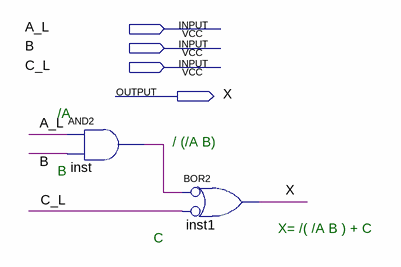
[diagram p0: schematic sheet]
// Quartus schematic first.bdf as structural Verilog: 2 symbols, 4 pins
module first (
  input  A_L,
  input  B,
  input  C_L,
  output X
);

  wire inst_out;

  and inst (inst_out, A_L, B);
  or inst1 (X, ~inst_out, ~C_L);  // BOR2

  // Notes on the sheet:
  //   /A
  //   / (/A B)
  //   B
  //   X= /( /A B ) + C
  //   C
endmodule
